# Altium schematic sheet bela_expansion_card_2.SchDoc
size 153 x 116 mm
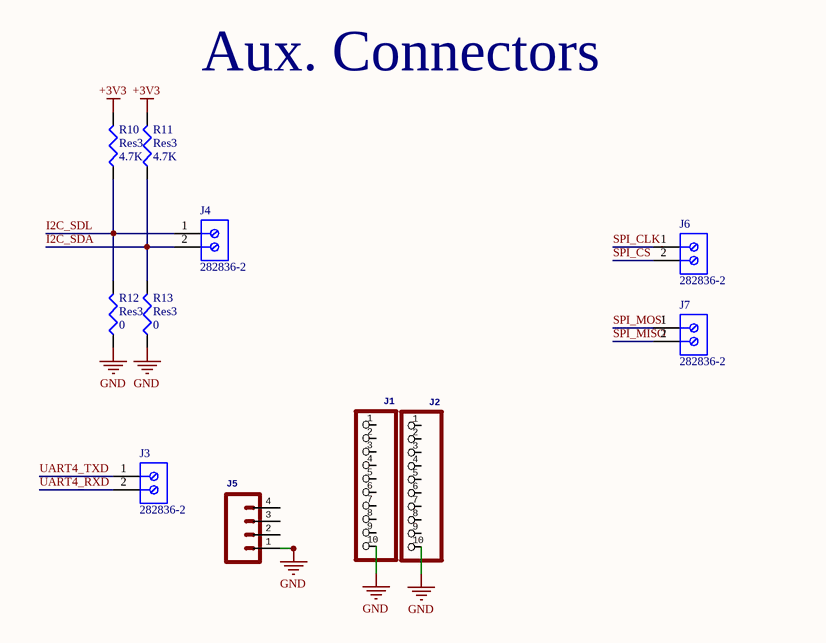
[diagram p0: bela_expansion_card_2.SchDoc]

## Parts
J1  PINHD-1X10  [HDR1X10]  (value not drawn)
J2  PINHD-1X10  [HDR1X10]  (value not drawn)
J3  282836-2  [TECO-282836-2_V]
J4  282836-2  [TECO-282836-2_V]
J5  M04PTH  [1X04]  (value not drawn)
J6  282836-2  [TECO-282836-2_V]
J7  282836-2  [TECO-282836-2_V]
R10  Res3  value 4.7K  [6-0805_L]
R11  Res3  value 4.7K  [6-0805_L]
R12  Res3  value 0  [6-0805_L]
R13  Res3  value 0  [6-0805_L]

## Nets
+3V3: R10.2 R11.2
GND: J1.10 J2.10 J5.1 R12.1 R13.1
I2C_SDA: J4.2 R11.1 R13.2
I2C_SDL: J4.1 R10.1 R12.2
SPI_CLK: J6.1
SPI_CS: J6.2
SPI_MISO: J7.2
SPI_MOSI: J7.1
UART4_RXD: J3.2
UART4_TXD: J3.1

Not connected (* = marked no-connect by the designer): J1 1 2 3 4 5 6 7 8 9; J2 1 2 3 4 5 6 7 8 9; J5 2 3 4

## Notes on the sheet
- Aux. Connectors

## Library data of the parts
J1 J2 = PINHD-1X10: PIN HEADER; GateName_1: A; SymbolName_1: PINHD10; LibraryName: pinhead; DeviceSetName: PINHD-1X10
J3 J4 J6 J7 = CMP-1684-00017-1: Female Header, Pitch 5 mm, 1 x 2 Position, Height 10 mm, Tail Length 3.5 mm, Rohs, Bulk; Manufacturer: TE Connectivity; Wire Gauge: 16-30AWG; Product Training Modules: Wire-to-BoardEurostyleTerminalBlocks; Clamp Material - Plating: Brass-NickelPlated; Voltage: 300V; Mating Orientation: HorizontalwithBoard; Current: 13.5A; Pitch: 0.197"(5.00mm); Screw Thread: M3; 3D Model: 282836-2.pdf; Other Names: 5ULV-02B / A98076; Dynamic Catalog: BuchananSeries; Number of Levels: 1; Torque - Screw: 0.68Nm(6Lb-In); Featured Product: EurostyleTerminalBlockConnectors; Positions Per Level: 2; Wire Termination: Screw-RisingCageClamp; Datasheet URL: http://www.te.com.cn/commerce/DocumentDelivery/DDEController?Action=showdoc&DocId=Catalog+Section%7F1308389_EUROSTYLE_TERMINAL_BLOCKS%7F0607%7Fpdf%7FEnglish%7FENG_CS_1308389_EUROSTYLE_TERMINAL_BLOCKS_0607.pdf%7F282836-2; Color: Green; Family: TerminalBlocks-WiretoBoard; RoHS Information: 282836-2StatementofCompliance; Standard Package: 300; Contact Material - Plating: Brass-TinPlated; Manufacturer URL: http://www.te.com; Housing Material: Polyamide(PA66),Nylon6/6; Features: Interlocking(Side); Package Description: Female Header, Pitch 5 mm, 1 x 2 Position, Height 10 mm, Tail Length 3.5 mm; Mounting Type: ThroughHole; Package Reference: THD; Packaging: Bulk; Series: Buchanan; Category: Connectors,Interconnects; Screw Material - Plating: Brass-NickelPlated
J5 = M04PTH: Header 4Standard 4-pin 0.1" header. Use with straight break away headers (SKU : PRT-00116), right angle break away headers (PRT-00553), swiss pins (PRT-00743), machine pins (PRT-00117), and female headers (PRT-00115). Molex polarized connector foot print use with SKU : PRT-08231 with associated crimp pins and housings. 1MM SMD Version SKU: PRT-10208; GateName_1: G$1; SymbolName_1: M04; DeviceName: PTH; MANEX: 258-0002845; LibraryName: SparkFun-Connectors; DeviceSetName: M04
R10-R13 = Res3: Resistor; Published: 8-Jun-2000; LatestRevisionDate: 29-May-2009; LatestRevisionNote: IPC-7351 Footprint Added.; PackageReference: J1-0603; Publisher: Altium Limited; PackageDescription: Chip Resistor